# Altium schematic sheet PS1connections.schdoc
size 1181 x 848 mm
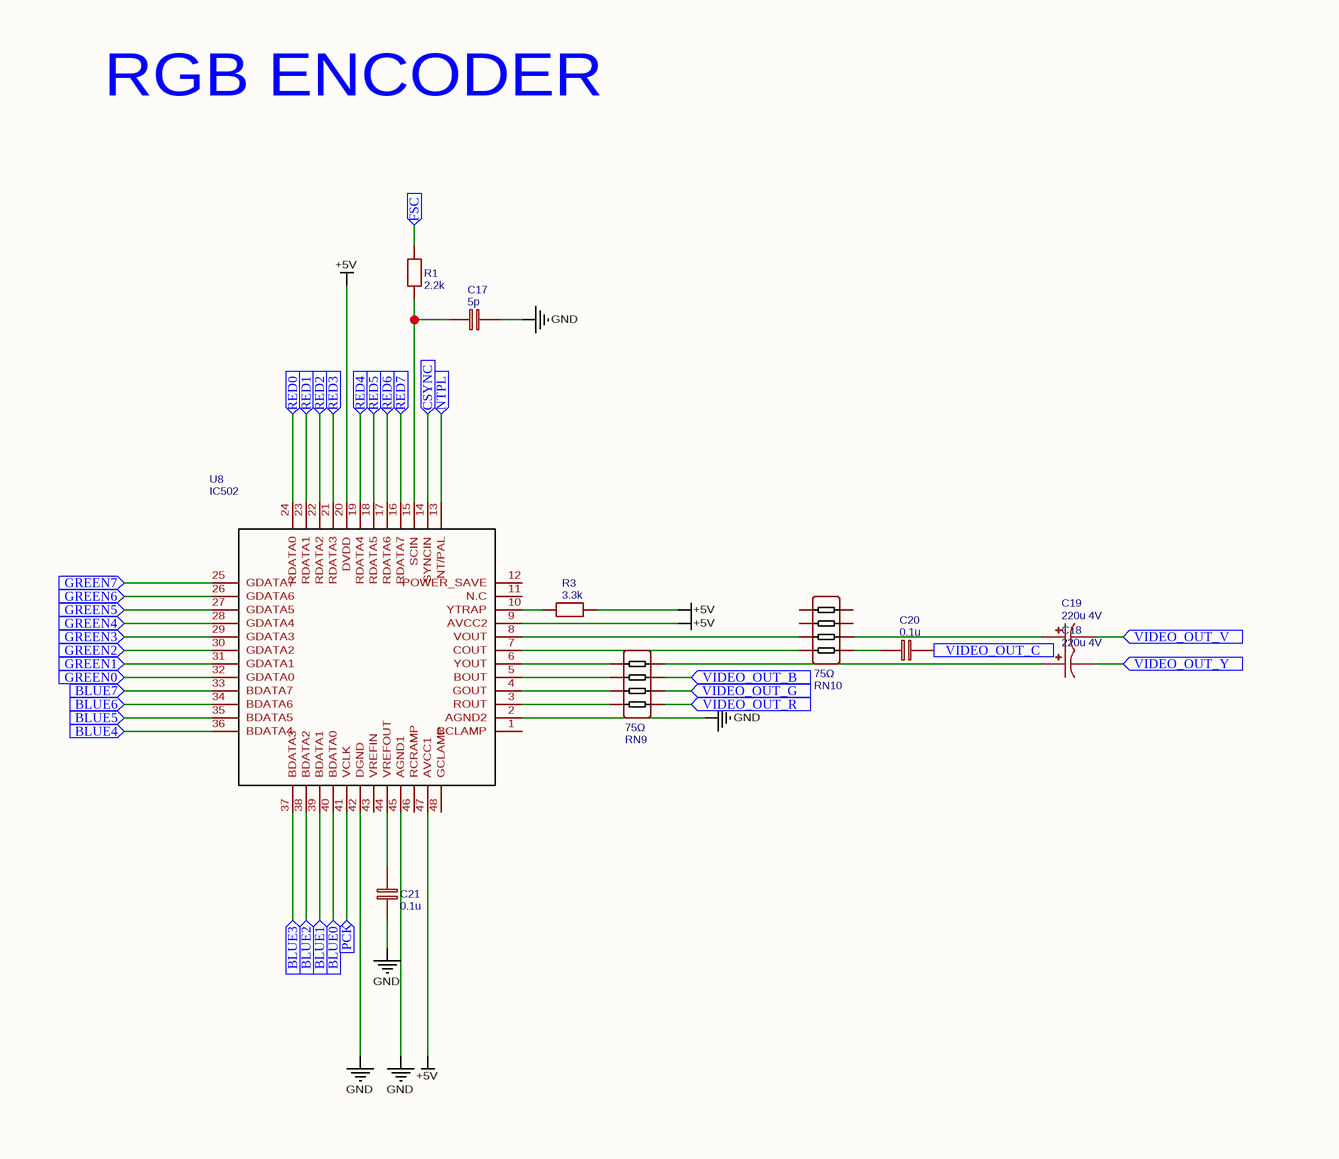
[diagram p0: PS1connections.schdoc, top column 1 of 4]
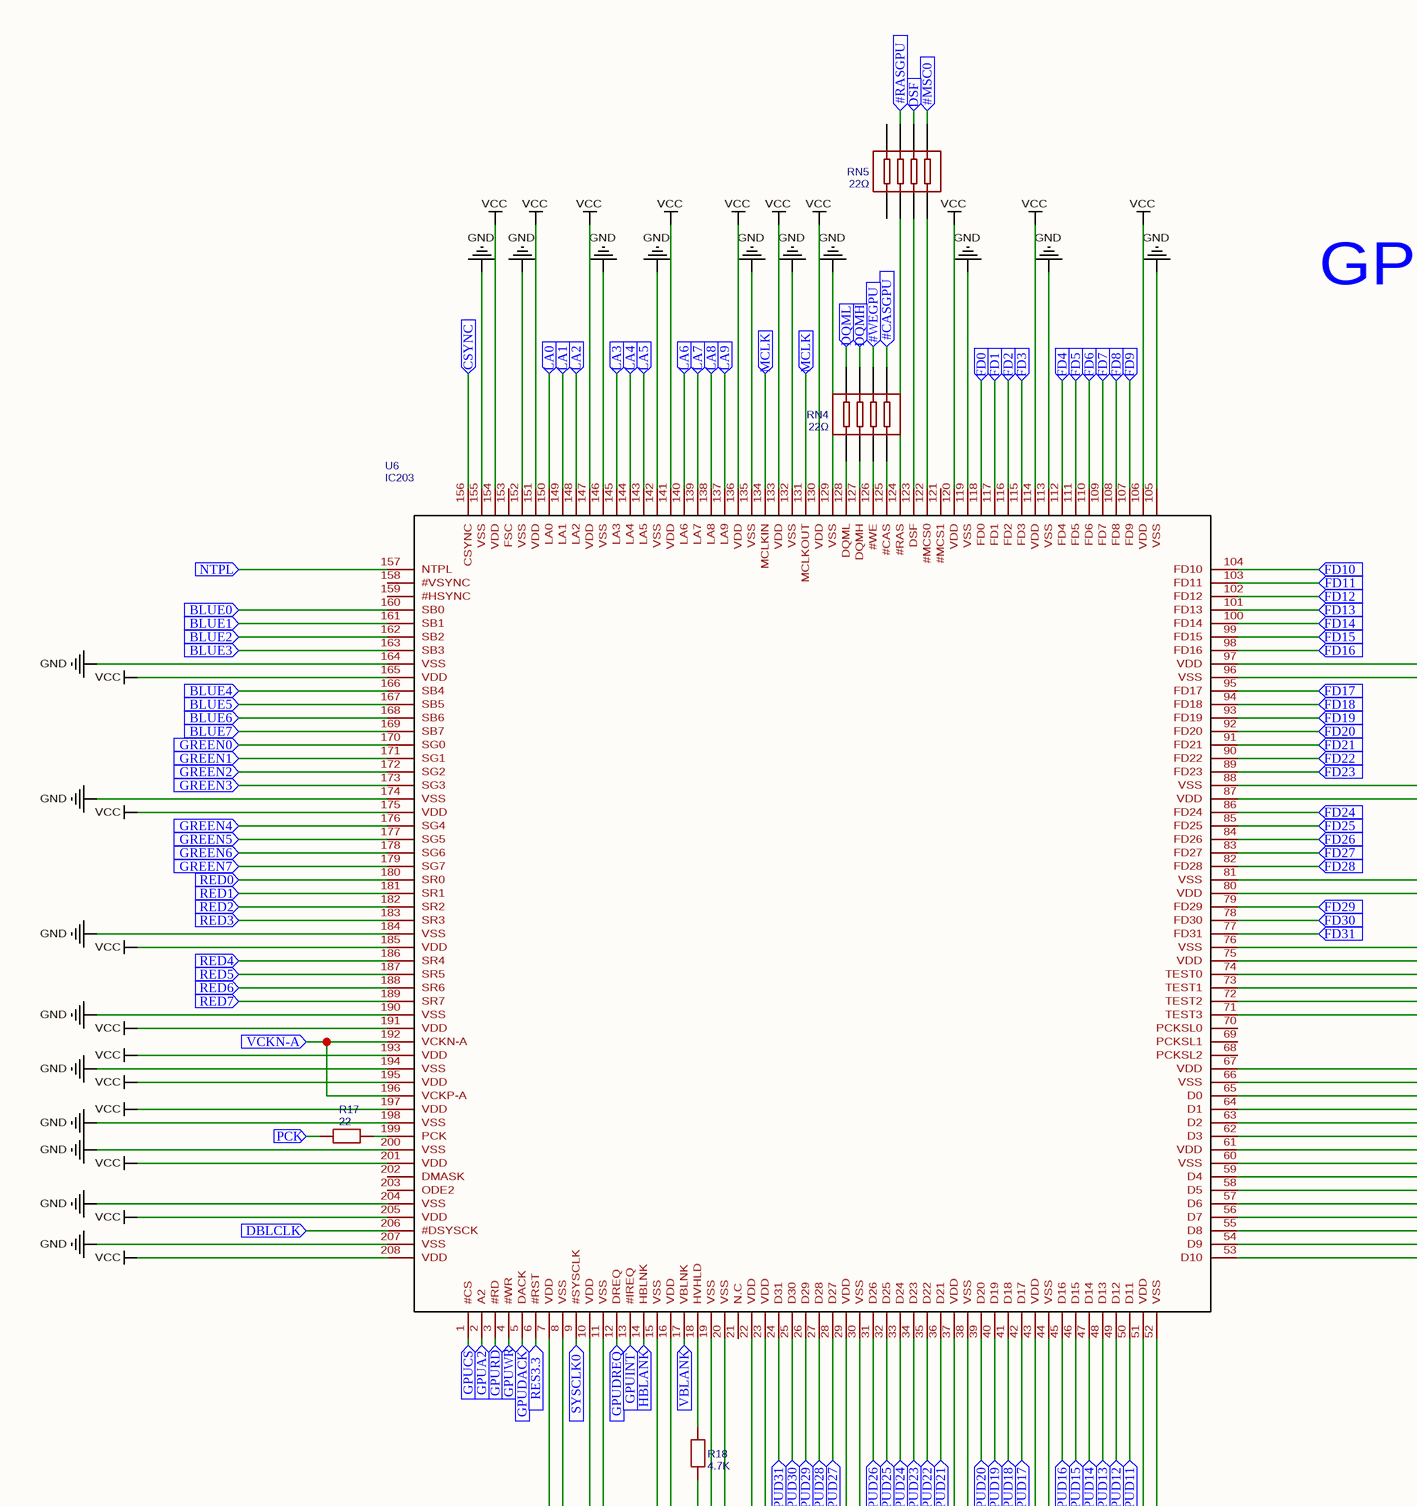
[diagram p1: PS1connections.schdoc, top column 2 of 4]
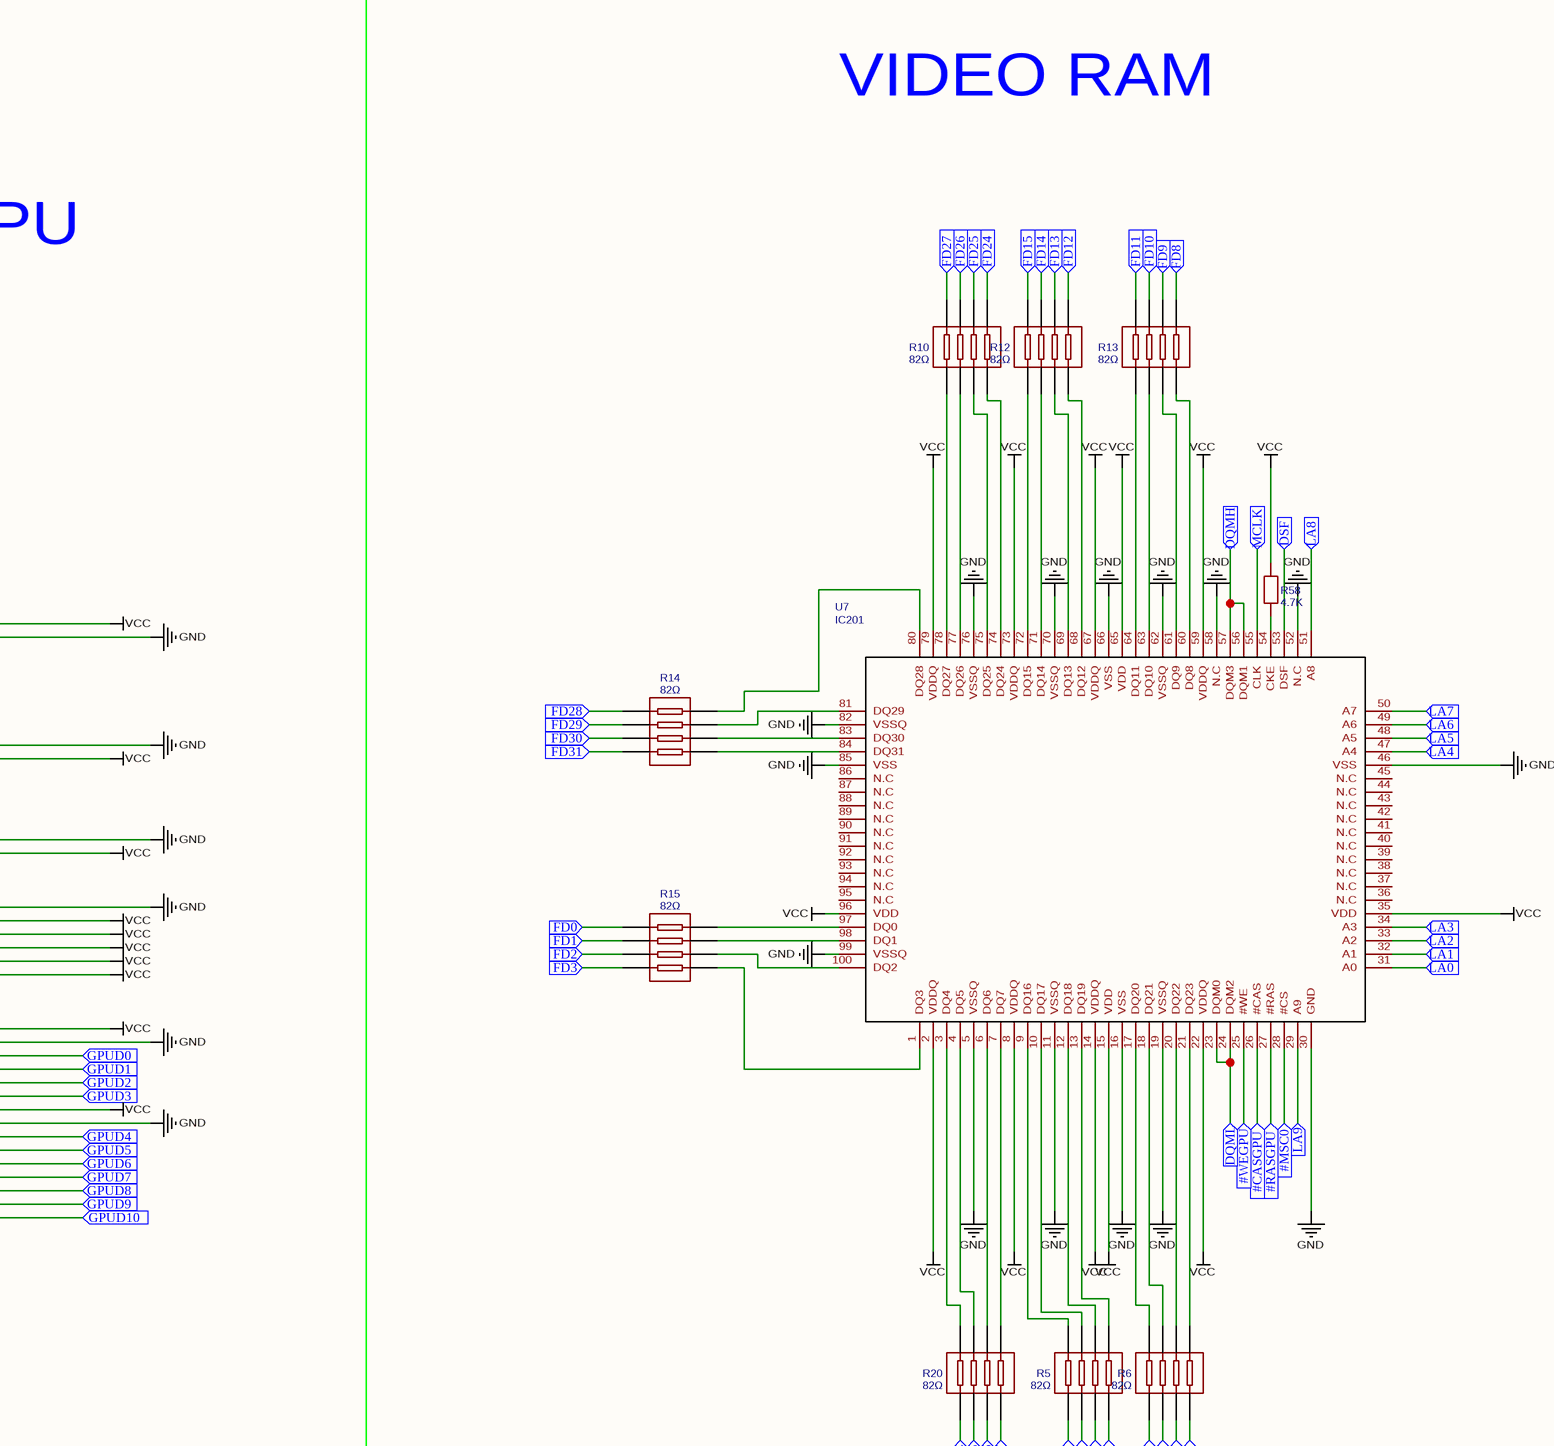
[diagram p2: PS1connections.schdoc, top column 3 of 4]
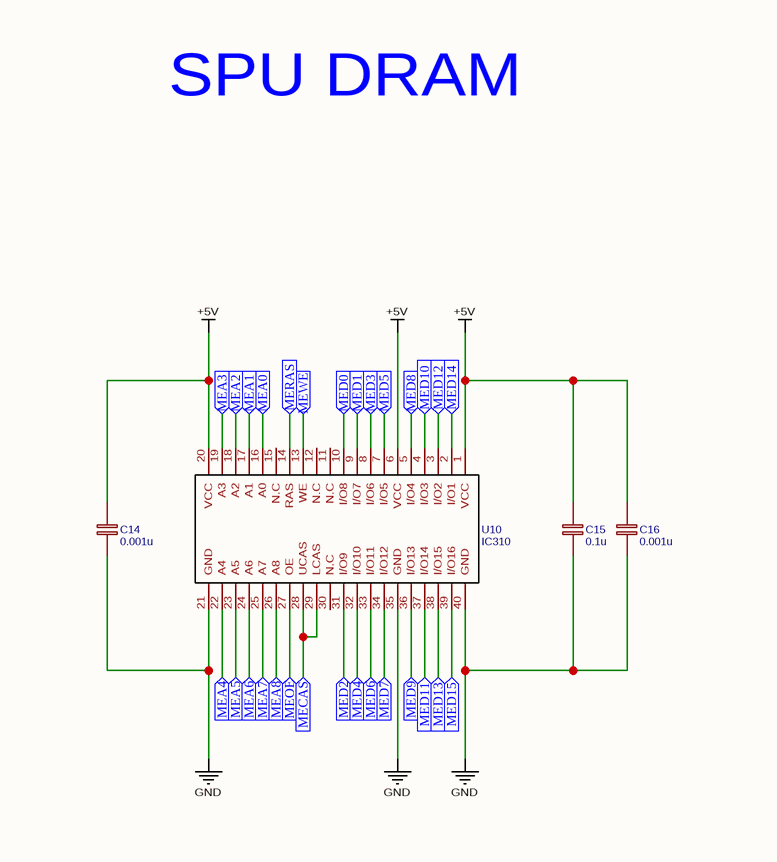
[diagram p3: PS1connections.schdoc, top column 4 of 4]
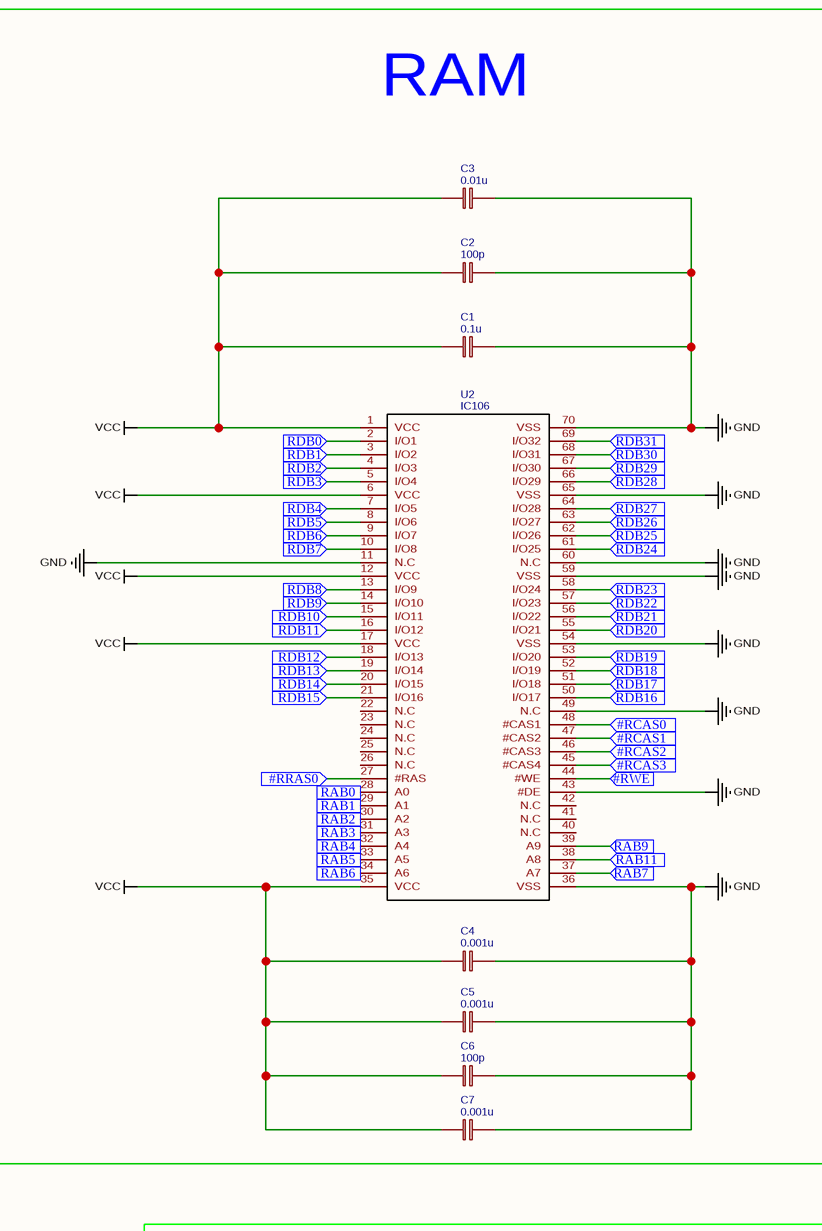
[diagram p4: PS1connections.schdoc, centre column 1 of 4]
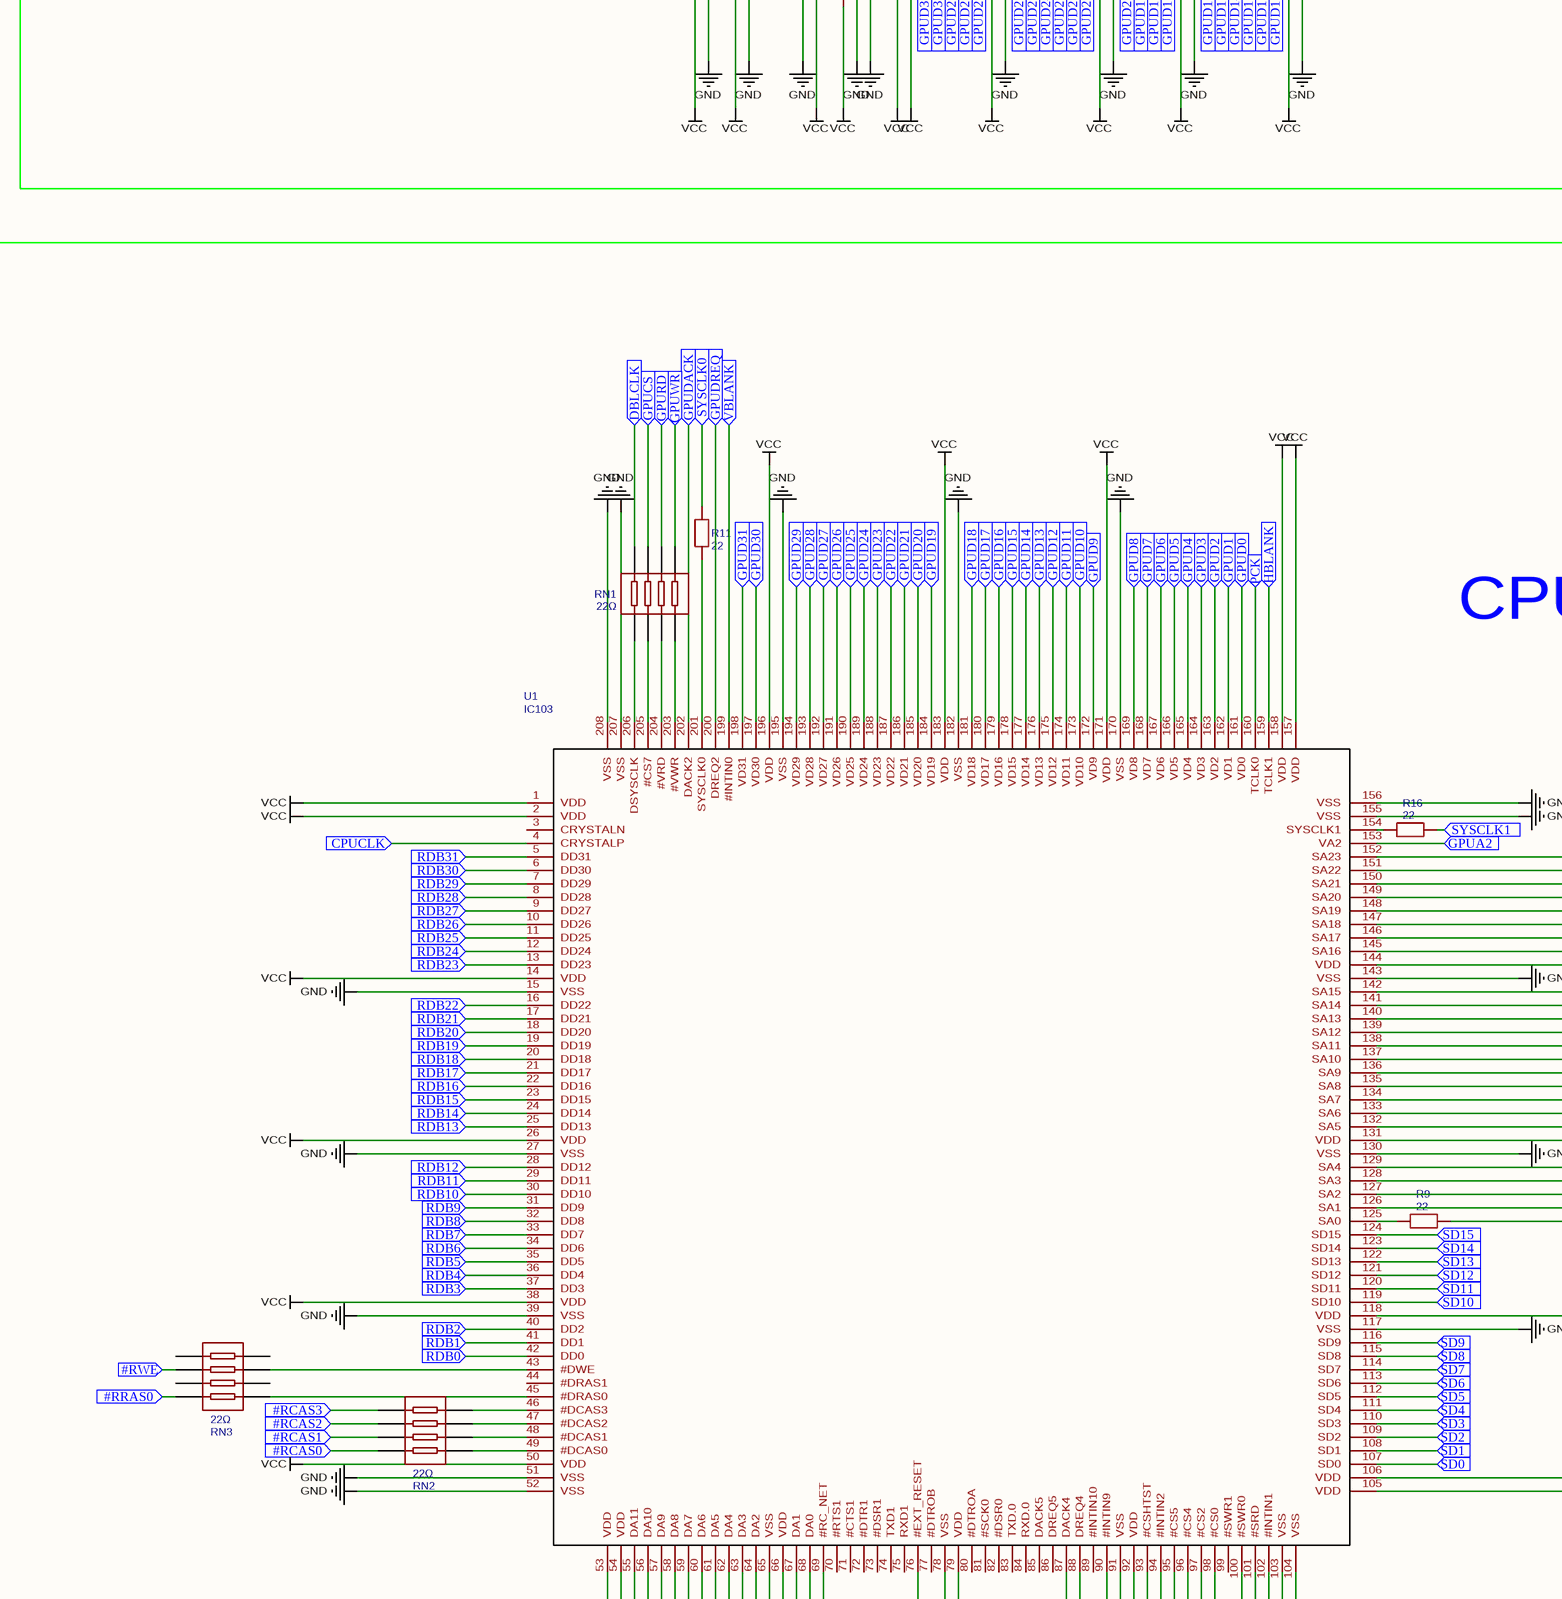
[diagram p5: PS1connections.schdoc, centre column 2 of 4]
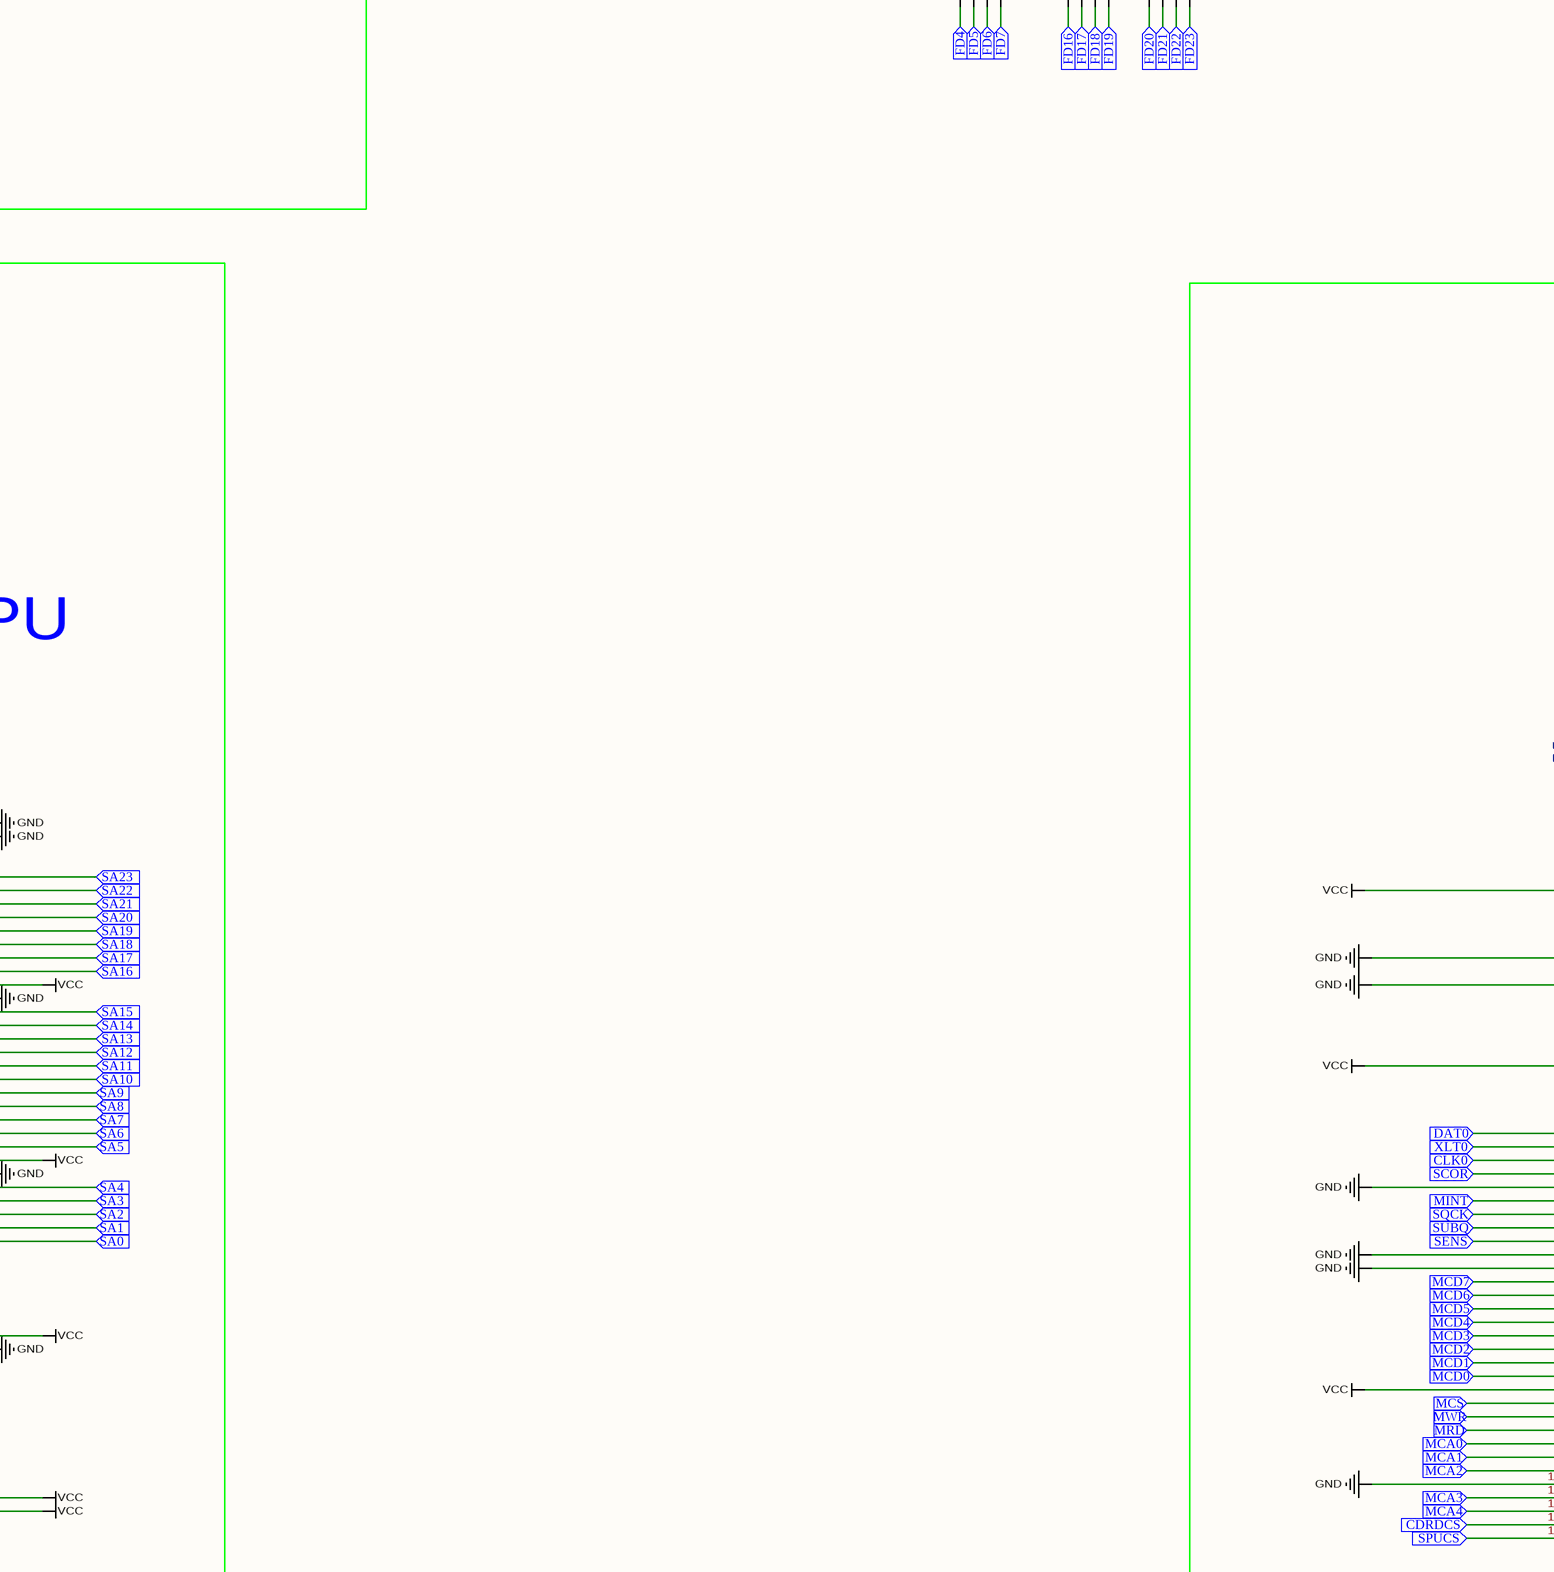
[diagram p6: PS1connections.schdoc, centre column 3 of 4]
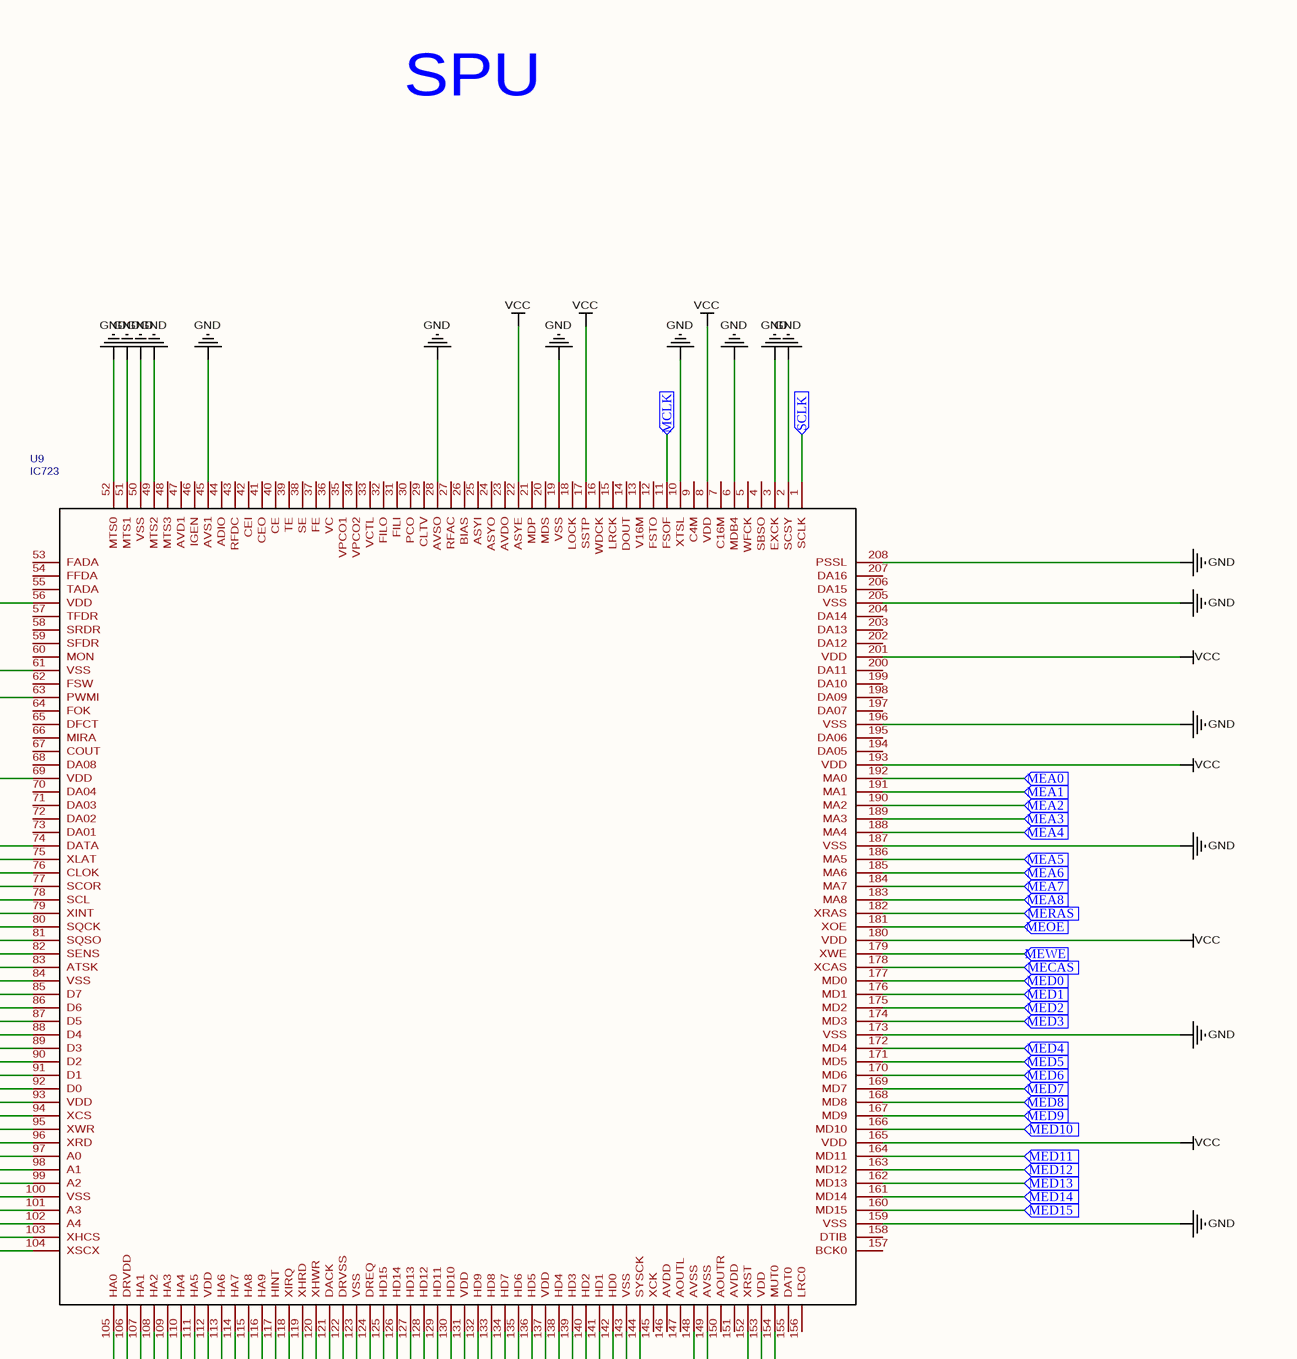
[diagram p7: PS1connections.schdoc, centre column 4 of 4]
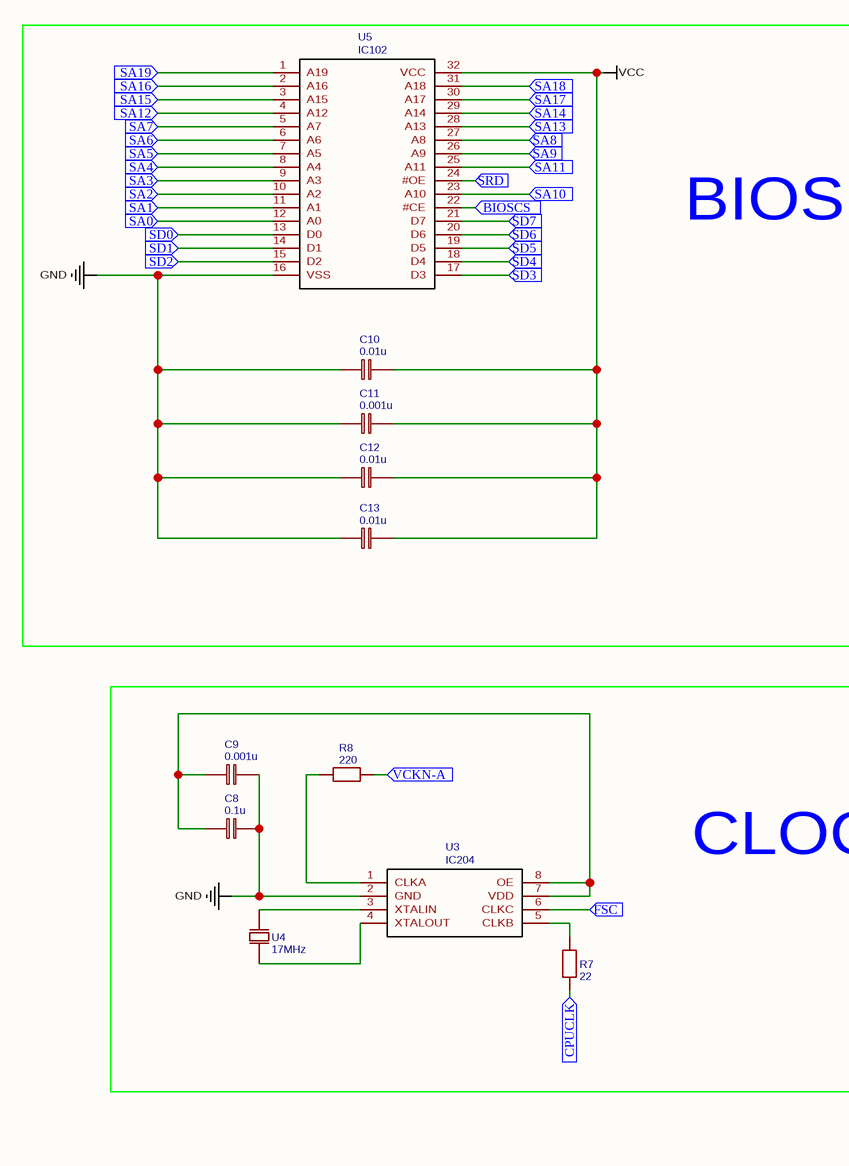
[diagram p8: PS1connections.schdoc, bottom column 1 of 4]
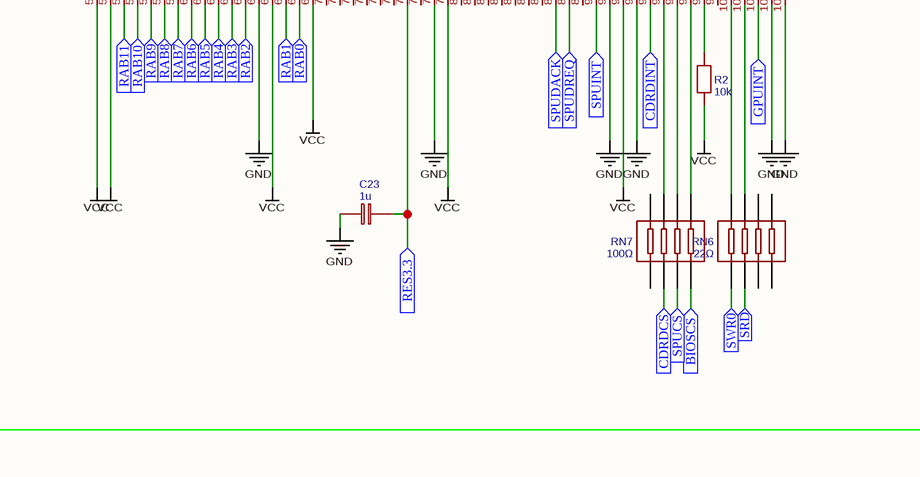
[diagram p9: PS1connections.schdoc, bottom column 2 of 4]
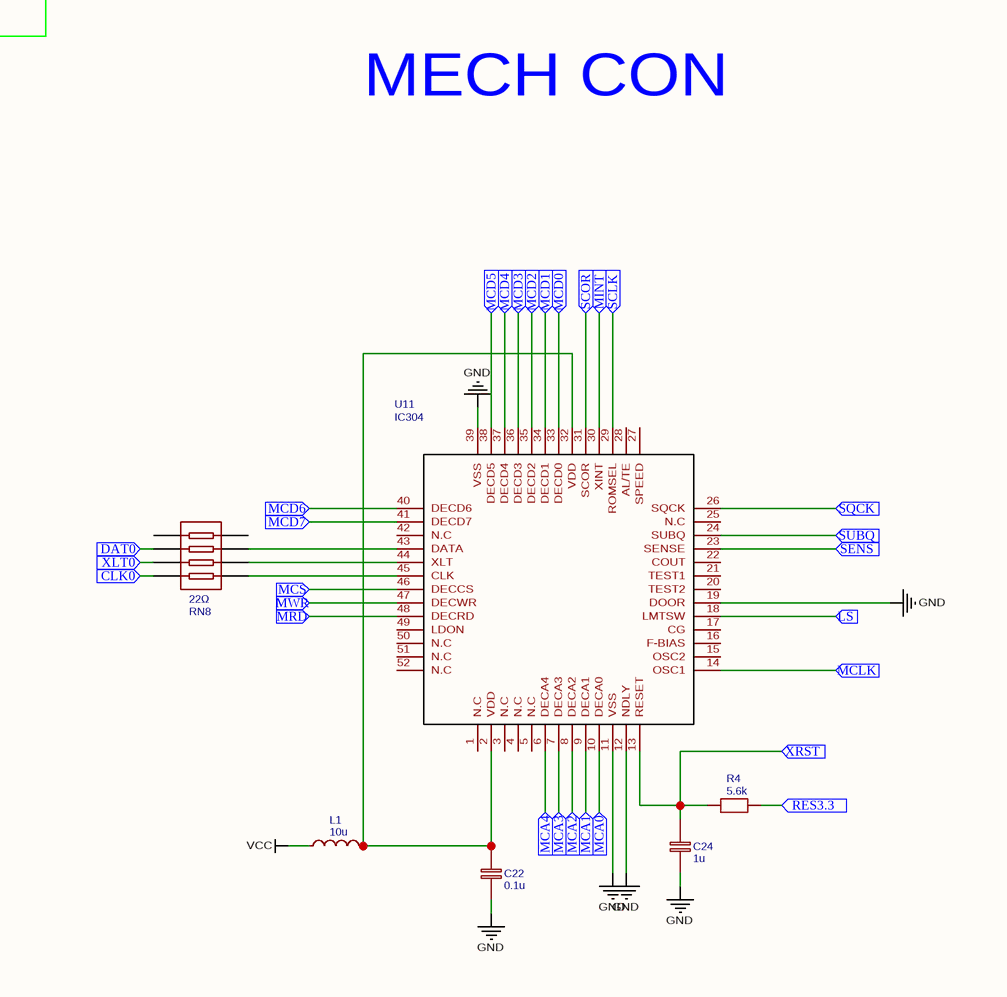
[diagram p10: PS1connections.schdoc, bottom column 3 of 4]
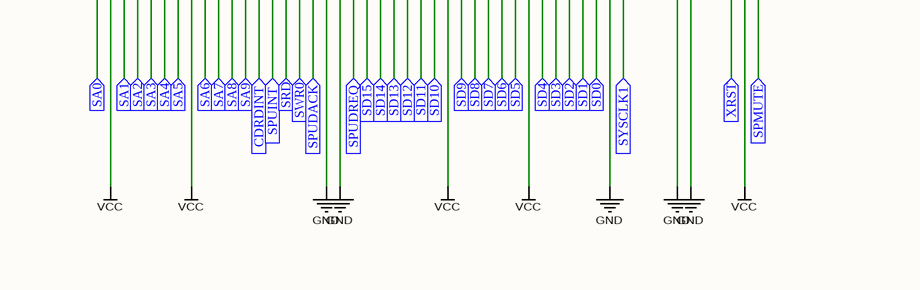
[diagram p11: PS1connections.schdoc, bottom column 4 of 4]

## Parts
C1  0.1u  [C0603]
C2  100p  [C0603]
C3  0.01u  [C0603]
C4  0.001u  [C0603]
C5  0.001u  [C0603]
C6  100p  [C0603]
C7  0.001u  [C0603]
C8  0.1u  [C0603]
C9  0.001u  [C0603]
C10  0.01u  [C0603]
C11  0.001u  [C0603]
C12  0.01u  [C0603]
C13  0.01u  [C0603]
C14  0.001u  [C0603]
C15  0.1u  [C0603]
C16  0.001u  [C0603]
C17  5p  [C0603]
C18  220u 4V  [CASE-A_3216]
C19  220u 4V  [CASE-A_3216]
C20  0.1u  [C0603]
C21  0.1u  [C0603]
C22  0.1u  [C0603]
C23  1u  [C0603]
C24  1u  [C0603]
L1  10u  [L0603]
R1  2.2k  [R0603]
R2  10k  [R0603]
R3  3.3k  [R0603]
R4  5.6k  [R0603]
R5  82Ω  [RES-ARRAY-SMD_8P-L2.0-W1.0-BL_CN24XXXX]
R6  82Ω  [RES-ARRAY-SMD_8P-L2.0-W1.0-BL_CN24XXXX]
R7  22  [R0603]
R8  220  [R0603]
R9  22  [R0603]
R10  82Ω  [RES-ARRAY-SMD_8P-L2.0-W1.0-BL_CN24XXXX]
R11  22  [R0603]
R12  82Ω  [RES-ARRAY-SMD_8P-L2.0-W1.0-BL_CN24XXXX]
R13  82Ω  [RES-ARRAY-SMD_8P-L2.0-W1.0-BL_CN24XXXX]
R14  82Ω  [RES-ARRAY-SMD_8P-L2.0-W1.0-BL_CN24XXXX]
R15  82Ω  [RES-ARRAY-SMD_8P-L2.0-W1.0-BL_CN24XXXX]
R16  22  [R0603]
R17  22  [R0603]
R18  4.7K  [R0603]
R20  82Ω  [RES-ARRAY-SMD_8P-L2.0-W1.0-BL_CN24XXXX]
R58  4.7K  [R0603]
RN1  22Ω  [RES-ARRAY-SMD_0402-8P-L2.0-W1.0-BL]
RN2  22Ω  [RES-ARRAY-SMD_0402-8P-L2.0-W1.0-BL]
RN3  22Ω  [RES-ARRAY-SMD_0402-8P-L2.0-W1.0-BL]
RN4  22Ω  [RES-ARRAY-SMD_0402-8P-L2.0-W1.0-BL]
RN5  22Ω  [RES-ARRAY-SMD_0402-8P-L2.0-W1.0-BL]
RN6  22Ω  [RES-ARRAY-SMD_0402-8P-L2.0-W1.0-BL]
RN7  100Ω  [RES-ARRAY-SMD_0402-8P-L2.0-W1.0-BL]
RN8  22Ω  [RES-ARRAY-SMD_0402-8P-L2.0-W1.0-BL]
RN9  75Ω  [RES-ARRAY-SMD_0402-8P-L2.0-W1.0-BL]
RN10  75Ω  [RES-ARRAY-SMD_0402-8P-L2.0-W1.0-BL]
U1  IC103  [LQFP-208_L28.0-W28.0-P0.50-LS30.0-BL]
U2  IC106  [SOJ-70_L27.0-W10.0-BL]
U3  IC204  [SOIC-8_L4.9-W3.9-P1.27-LS6.0-BL]
U4  17MHz  [CRYSTAL-SMD_L11.4-W3.8-LS13.4_HC-49S-SMD]
U5  IC102  [SOP-32_L20.9-W11.4-P1.27-LS14.12-BL]
U6  IC203  [LQFP-208_L28.0-W28.0-P0.50-LS30.0-BL]
U7  IC201  [LQFP-100_L20.0-W14.0-P0.65-LS16.0-BL-1]
U8  IC502  [QFP-48_L7.0-W7.0-P0.50-LS9.0-BL]
U9  IC723  [LQFP-208_L28.0-W28.0-P0.50-LS30.0-BL]
U10  IC310  [SOJ-40_L25.8-W10.2-P1.27-LS11.2-BL]
U11  IC304  [LQFP-52_L10.0-W10.0-P0.65-LS12.0-BL]

## Blocks framed on the sheet
GPU: R17 R18 RN4 RN5 U6
SPU DRAM: C14-C16 U10
RAM: C1-C7 U2
CPU: C23 R2 R9 R11 R16 RN1-RN3 RN6 RN7 U1
SPU: U9
BIOS ROM: C10-C13 U5
CLOCK GEN: C8 C9 R7 R8 U3 U4

## Ports
#CASGPU (in), #MSC0 (in), #RASGPU (in), #RCAS0 (in), #RCAS1 (in), #RCAS2 (in), #RCAS3 (in), #RRAS0 (in), #RWE (in), #WEGPU (in), BIOSCS (in), BLUE0 (in), BLUE1 (in), BLUE2 (in), BLUE3 (in), BLUE4 (in), BLUE5 (in), BLUE6 (in), BLUE7 (in), CDRDCS (in), CDRDINT (in), CLK0 (in), CPUCLK (in), CSYNC (in), DAT0 (in), DBLCLK (in), DQMH (in), DQML (in), DSF (in), FD0 (in), FD1 (in), FD2 (in), FD3 (in), FD4 (in), FD5 (in), FD6 (in), FD7 (in), FD8 (in), FD9 (in), FD10 (in), FD11 (in), FD12 (in), FD13 (in), FD14 (in), FD15 (in), FD16 (in), FD17 (in), FD18 (in), FD19 (in), FD20 (in), FD21 (in), FD22 (in), FD23 (in), FD24 (in), FD25 (in), FD26 (in), FD27 (in), FD28 (in), FD29 (in), FD30 (in), FD31 (in), FSC (in), GPUA2 (in), GPUCS (in), GPUD0 (in), GPUD1 (in), GPUD2 (in), GPUD3 (in), GPUD4 (in), GPUD5 (in), GPUD6 (in), GPUD7 (in), GPUD8 (in), GPUD9 (in), GPUD10 (in), GPUD11 (in), GPUD12 (in), GPUD13 (in), GPUD14 (in), GPUD15 (in), GPUD16 (in), GPUD17 (in), GPUD18 (in), GPUD19 (in), GPUD20 (in), GPUD21 (in), GPUD22 (in), GPUD23 (in), GPUD24 (in), GPUD25 (in), GPUD26 (in), GPUD27 (in), GPUD28 (in), GPUD29 (in), GPUD30 (in), GPUD31 (in), GPUDACK (in), GPUDREQ (in), GPUINT (in), GPURD (in), GPUWR (in), GREEN0 (in), GREEN1 (in), GREEN2 (in), GREEN3 (in), GREEN4 (in), GREEN5 (in), GREEN6 (in), GREEN7 (in), HBLANK (in), LA0 (in), LA1 (in), LA2 (in), LA3 (in), LA4 (in), LA5 (in), LA6 (in), LA7 (in), LA8 (in), LA9 (in), LS (in), MCA0 (in), MCA1 (in), MCA2 (in), MCA3 (in), MCA4 (in), MCD0 (in), MCD1 (in), MCD2 (in), MCD3 (in), MCD4 (in), MCD5 (in), MCD6 (in), MCD7 (in), MCLK (in), MCS (in), MEA0 (in), MEA1 (in), MEA2 (in), MEA3 (in), MEA4 (in), MEA5 (in), MEA6 (in), MEA7 (in), MEA8 (in), MECAS (in), MED0 (in), MED1 (in), MED2 (in), MED3 (in), MED4 (in), MED5 (in), MED6 (in), MED7 (in), MED8 (in), MED9 (in), MED10 (in), MED11 (in), MED12 (in), MED13 (in), MED14 (in), MED15 (in), MEOE (in), MERAS (in), MEWE (in), MINT (in), MRD (in), MWR (in), NTPL (in), PCK (in), RAB0 (in), RAB1 (in), RAB2 (in), RAB3 (in), RAB4 (in), RAB5 (in), RAB6 (in), RAB7 (in), RAB8 (in), RAB9 (in), RAB10 (in), RAB11 (in), RDB0 (in), RDB1 (in), RDB2 (in), RDB3 (in), RDB4 (in), RDB5 (in), RDB6 (in), RDB7 (in), RDB8 (in), RDB9 (in), RDB10 (in), RDB11 (in), RDB12 (in), RDB13 (in), RDB14 (in), RDB15 (in), RDB16 (in), RDB17 (in), RDB18 (in), RDB19 (in), RDB20 (in), RDB21 (in), RDB22 (in), RDB23 (in), RDB24 (in), RDB25 (in), RDB26 (in), RDB27 (in), RDB28 (in), RDB29 (in), RDB30 (in), RDB31 (in), RED0 (in), RED1 (in), RED2 (in), RED3 (in), RED4 (in), RED5 (in), RED6 (in), RED7 (in), RES3.3 (in), SA0 (in), SA1 (in), SA2 (in), SA3 (in), SA4 (in), SA5 (in), SA6 (in), SA7 (in), SA8 (in), SA9 (in), SA10 (in), SA11 (in), SA12 (in), SA13 (in), SA14 (in), SA15 (in), SA16 (in), SA17 (in), SA18 (in), SA19 (in), SA20 (in), SA21 (in), SA22 (in), SA23 (in), SCLK (in), SCOR (in), SD0 (in), SD1 (in), SD2 (in), SD3 (in), SD4 (in), SD5 (in), SD6 (in), SD7 (in), SD8 (in), SD9 (in), SD10 (in), SD11 (in), SD12 (in), SD13 (in), SD14 (in), SD15 (in), SENS (in), SPMUTE (in), SPUCS (in), SPUDACK (in), SPUDREQ (in), SPUINT (in), SQCK (in), SRD (in), SUBQ (in), SWR0 (in), SYSCLK0 (in), SYSCLK1 (in), VBLANK (in), VCKN-A (in), VIDEO_OUT_B (in), VIDEO_OUT_C (in), VIDEO_OUT_G (in), VIDEO_OUT_R (in), VIDEO_OUT_V (in), VIDEO_OUT_Y (in), XLT0 (in), XRST (in)

## Nets
+5V: C14.2 C15.2 C16.2 R3.2 U8.9(AVCC2) U8.20(DVDD) U8.47(AVCC1) U10.1(VCC) U10.6(VCC) U10.20(VCC)
GND: C1.2 C2.2 C3.2 C4.2 C5.2 C6.2 C7.2 C8.2 C9.2 C10.1 C11.1 C12.1 C13.1 C14.1 C15.1 C16.1 C17.2 C21.1 C22.1 C23.1 C24.1 U1.15(VSS) U1.27(VSS) U1.39(VSS) U1.51(VSS) U1.52(VSS) U1.65(VSS) U1.78(VSS) U1.91(VSS) U1.93(#CSHTST) U1.103(VSS) U1.104(VSS) U1.117(VSS) U1.130(VSS) U1.143(VSS) U1.155(VSS) U1.156(VSS) U1.170(VSS) U1.182(VSS) U1.195(VSS) U1.207(VSS) U1.208(VSS) U2.11(N.C) U2.36(VSS) U2.43(#DE) U2.49(N.C) U2.54(VSS) U2.59(VSS) U2.60(N.C) U2.65(VSS) U2.70(VSS) U3.2(GND) U5.16(VSS) U6.8(VSS) U6.11(VSS) U6.15(VSS) U6.19(VSS) U6.20(VSS) U6.30(VSS) U6.38(VSS) U6.44(VSS) U6.52(VSS) U6.60(VSS) U6.66(VSS) U6.76(VSS) U6.81(VSS) U6.88(VSS) U6.96(VSS) U6.105(VSS) U6.113(VSS) U6.119(VSS) U6.129(VSS) U6.132(VSS) U6.135(VSS) U6.142(VSS) U6.146(VSS) U6.152(VSS) U6.155(VSS) U6.164(VSS) U6.174(VSS) U6.184(VSS) U6.190(VSS) U6.194(VSS) U6.198(VSS) U6.200(VSS) U6.204(VSS) U6.207(VSS) U7.5(VSSQ) U7.11(VSSQ) U7.16(VSS) U7.19(VSSQ) U7.30(GND) U7.46(VSS) U7.52(N.C) U7.58(N.C) U7.62(VSSQ) U7.66(VSS) U7.70(VSSQ) U7.76(VSSQ) U7.82(VSSQ) U7.85(VSS) U7.99(VSSQ) U8.2(AGND2) U8.42(DGND) U8.45(AGND1) U9.2(SCSY) U9.3(EXCK) U9.6(MDB4) U9.10(XTSL) U9.19(VSS) U9.28(AVSO) U9.45(AVS1) U9.49(MTS2) U9.50(VSS) U9.51(MTS1) U9.52(MTS0) U9.61(VSS) U9.63(PWMI) U9.78(SCL) U9.83(ATSK) U9.84(VSS) U9.100(VSS) U9.122(DRVSS) U9.123(VSS) U9.143(VSS) U9.148(AVSS) U9.149(AVSS) U9.159(VSS) U9.173(VSS) U9.187(VSS) U9.196(VSS) U9.205(VSS) U9.208(PSSL) U10.21(GND) U10.35(GND) U10.40(GND) U11.11(VSS) U11.12(NDLY) U11.19(DOOR) U11.39(VSS)
VCC: C1.1 C2.1 C3.1 C4.1 C5.1 C6.1 C7.1 C10.2 C11.2 C12.2 C13.2 L1.1 R2.1 R18.2 R58.2 U1.1(VDD) U1.2(VDD) U1.14(VDD) U1.26(VDD) U1.38(VDD) U1.50(VDD) U1.53(VDD) U1.54(VDD) U1.66(VDD) U1.69(#RC_NET) U1.79(VDD) U1.92(VDD) U1.105(VDD) U1.106(VDD) U1.118(VDD) U1.131(VDD) U1.144(VDD) U1.157(VDD) U1.158(VDD) U1.171(VDD) U1.183(VDD) U1.196(VDD) U2.1(VCC) U2.6(VCC) U2.12(VCC) U2.17(VCC) U2.35(VCC) U5.32(VCC) U6.7(VDD) U6.10(VDD) U6.16(VDD) U6.22(VDD) U6.23(VDD) U6.29(VDD) U6.37(VDD) U6.43(VDD) U6.51(VDD) U6.61(VDD) U6.67(VDD) U6.71(TEST3) U6.72(TEST2) U6.73(TEST1) U6.74(TEST0) U6.75(VDD) U6.80(VDD) U6.87(VDD) U6.97(VDD) U6.106(VDD) U6.114(VDD) U6.120(VDD) U6.130(VDD) U6.133(VDD) U6.136(VDD) U6.141(VDD) U6.147(VDD) U6.151(VDD) U6.154(VDD) U6.165(VDD) U6.175(VDD) U6.185(VDD) U6.191(VDD) U6.193(VDD) U6.195(VDD) U6.197(VDD) U6.201(VDD) U6.205(VDD) U6.208(VDD) U7.2(VDDQ) U7.8(VDDQ) U7.14(VDDQ) U7.15(VDD) U7.22(VDDQ) U7.35(VDD) U7.59(VDDQ) U7.65(VDD) U7.67(VDDQ) U7.73(VDDQ) U7.79(VDDQ) U7.96(VDD) U9.8(VDD) U9.17(SSTP) U9.22(ASYE) U9.56(VDD) U9.69(VDD) U9.93(VDD) U9.106(DRVDD) U9.112(VDD) U9.131(VDD) U9.137(VDD) U9.153(VDD) U9.165(VDD) U9.180(VDD) U9.193(VDD) U9.201(VDD)
#CASGPU: RN4.8 U7.26(#CAS) ; port #CASGPU
#MSC0: RN5.8 U7.28(#CS) ; port #MSC0
#RASGPU: RN5.6 U7.27(#RAS) ; port #RASGPU
#RCAS0: RN2.5 U2.48(#CAS1) ; port #RCAS0
#RCAS1: RN2.6 U2.47(#CAS2) ; port #RCAS1
#RCAS2: RN2.7 U2.46(#CAS3) ; port #RCAS2
#RCAS3: RN2.8 U2.45(#CAS4) ; port #RCAS3
#RRAS0: RN3.5 U2.27(#RAS) ; port #RRAS0
#RWE: RN3.7 U2.44(#WE) ; port #RWE
#WEGPU: RN4.7 U7.25(#WE) ; port #WEGPU
BIOSCS: RN7.1 U5.22(#CE) ; port BIOSCS
BLUE0: U6.160(SB0) U8.40(BDATA0) ; port BLUE0
BLUE1: U6.161(SB1) U8.39(BDATA1) ; port BLUE1
BLUE2: U6.162(SB2) U8.38(BDATA2) ; port BLUE2
BLUE3: U6.163(SB3) U8.37(BDATA3) ; port BLUE3
BLUE4: U6.166(SB4) U8.36(BDATA4) ; port BLUE4
BLUE5: U6.167(SB5) U8.35(BDATA5) ; port BLUE5
BLUE6: U6.168(SB6) U8.34(BDATA6) ; port BLUE6
BLUE7: U6.169(SB7) U8.33(BDATA7) ; port BLUE7
CDRDCS: RN7.3 U9.103(XHCS) ; port CDRDCS
CDRDINT: U1.94(#INTIN2) U9.117(HINT) ; port CDRDINT
CLK0: RN8.1 U9.76(CLOK) ; port CLK0
CPUCLK: R7.1 U1.4(CRYSTALP) ; port CPUCLK
CSYNC: U6.156(CSYNC) U8.14(SYNCIN) ; port CSYNC
DAT0: RN8.3 U9.74(DATA) ; port DAT0
DBLCLK: RN1.5 U6.206(#DSYSCK) ; port DBLCLK
DQMH: RN4.6 U7.56(DQM1) U7.57(DQM3) ; port DQMH
DQML: RN4.5 U7.23(DQM0) U7.24(DQM2) ; port DQML
DSF: RN5.7 U7.53(DSF) ; port DSF
FD0: R15.8 U6.118(FD0) ; port FD0
FD1: R15.7 U6.117(FD1) ; port FD1
FD2: R15.6 U6.116(FD2) ; port FD2
FD3: R15.5 U6.115(FD3) ; port FD3
FD4: R20.4 U6.112(FD4) ; port FD4
FD5: R20.3 U6.111(FD5) ; port FD5
FD6: R20.2 U6.110(FD6) ; port FD6
FD7: R20.1 U6.109(FD7) ; port FD7
FD8: R13.8 U6.108(FD8) ; port FD8
FD9: R13.7 U6.107(FD9) ; port FD9
FD10: R13.6 U6.104(FD10) ; port FD10
FD11: R13.5 U6.103(FD11) ; port FD11
FD12: R12.8 U6.102(FD12) ; port FD12
FD13: R12.7 U6.101(FD13) ; port FD13
FD14: R12.6 U6.100(FD14) ; port FD14
FD15: R12.5 U6.99(FD15) ; port FD15
FD16: R5.4 U6.98(FD16) ; port FD16
FD17: R5.3 U6.95(FD17) ; port FD17
FD18: R5.2 U6.94(FD18) ; port FD18
FD19: R5.1 U6.93(FD19) ; port FD19
FD20: R6.4 U6.92(FD20) ; port FD20
FD21: R6.3 U6.91(FD21) ; port FD21
FD22: R6.2 U6.90(FD22) ; port FD22
FD23: R6.1 U6.89(FD23) ; port FD23
FD24: R10.8 U6.86(FD24) ; port FD24
FD25: R10.7 U6.85(FD25) ; port FD25
FD26: R10.6 U6.84(FD26) ; port FD26
FD27: R10.5 U6.83(FD27) ; port FD27
FD28: R14.8 U6.82(FD28) ; port FD28
FD29: R14.7 U6.79(FD29) ; port FD29
FD30: R14.6 U6.78(FD30) ; port FD30
FD31: R14.5 U6.77(FD31) ; port FD31
FSC: R1.2 U3.6(CLKC) ; port FSC
GPUA2: U1.153(VA2) U6.2(A2) ; port GPUA2
GPUCS: RN1.6 U6.1(#CS) ; port GPUCS
GPUD0: U1.161(VD0) U6.65(D0) ; port GPUD0
GPUD1: U1.162(VD1) U6.64(D1) ; port GPUD1
GPUD2: U1.163(VD2) U6.63(D2) ; port GPUD2
GPUD3: U1.164(VD3) U6.62(D3) ; port GPUD3
GPUD4: U1.165(VD4) U6.59(D4) ; port GPUD4
GPUD5: U1.166(VD5) U6.58(D5) ; port GPUD5
GPUD6: U1.167(VD6) U6.57(D6) ; port GPUD6
GPUD7: U1.168(VD7) U6.56(D7) ; port GPUD7
GPUD8: U1.169(VD8) U6.55(D8) ; port GPUD8
GPUD9: U1.172(VD9) U6.54(D9) ; port GPUD9
GPUD10: U1.173(VD10) U6.53(D10) ; port GPUD10
GPUD11: U1.174(VD11) U6.50(D11) ; port GPUD11
GPUD12: U1.175(VD12) U6.49(D12) ; port GPUD12
GPUD13: U1.176(VD13) U6.48(D13) ; port GPUD13
GPUD14: U1.177(VD14) U6.47(D14) ; port GPUD14
GPUD15: U1.178(VD15) U6.46(D15) ; port GPUD15
GPUD16: U1.179(VD16) U6.45(D16) ; port GPUD16
GPUD17: U1.180(VD17) U6.42(D17) ; port GPUD17
GPUD18: U1.181(VD18) U6.41(D18) ; port GPUD18
GPUD19: U1.184(VD19) U6.40(D19) ; port GPUD19
GPUD20: U1.185(VD20) U6.39(D20) ; port GPUD20
GPUD21: U1.186(VD21) U6.36(D21) ; port GPUD21
GPUD22: U1.187(VD22) U6.35(D22) ; port GPUD22
GPUD23: U1.188(VD23) U6.34(D23) ; port GPUD23
GPUD24: U1.189(VD24) U6.33(D24) ; port GPUD24
GPUD25: U1.190(VD25) U6.32(D25) ; port GPUD25
GPUD26: U1.191(VD26) U6.31(D26) ; port GPUD26
GPUD27: U1.192(VD27) U6.28(D27) ; port GPUD27
GPUD28: U1.193(VD28) U6.27(D28) ; port GPUD28
GPUD29: U1.194(VD29) U6.26(D29) ; port GPUD29
GPUD30: U1.197(VD30) U6.25(D30) ; port GPUD30
GPUD31: U1.198(VD31) U6.24(D31) ; port GPUD31
GPUDACK: U1.202(DACK2) U6.5(DACK) ; port GPUDACK
GPUDREQ: U1.200(DREQ2) U6.12(DREQ) ; port GPUDREQ
GPUINT: U1.102(#INTIN1) U6.13(#IREQ) ; port GPUINT
GPURD: RN1.7 U6.3(#RD) ; port GPURD
GPUWR: RN1.8 U6.4(#WR) ; port GPUWR
GREEN0: U6.170(SG0) U8.32(GDATA0) ; port GREEN0
GREEN1: U6.171(SG1) U8.31(GDATA1) ; port GREEN1
GREEN2: U6.172(SG2) U8.30(GDATA2) ; port GREEN2
GREEN3: U6.173(SG3) U8.29(GDATA3) ; port GREEN3
GREEN4: U6.176(SG4) U8.28(GDATA4) ; port GREEN4
GREEN5: U6.177(SG5) U8.27(GDATA5) ; port GREEN5
GREEN6: U6.178(SG6) U8.26(GDATA6) ; port GREEN6
GREEN7: U6.179(SG7) U8.25(GDATA7) ; port GREEN7
HBLANK: U1.159(TCLK1) U6.14(HBLNK) ; port HBLANK
LA0: U6.150(LA0) U7.31(A0) ; port LA0
LA1: U6.149(LA1) U7.32(A1) ; port LA1
LA2: U6.148(LA2) U7.33(A2) ; port LA2
LA3: U6.145(LA3) U7.34(A3) ; port LA3
LA4: U6.144(LA4) U7.47(A4) ; port LA4
LA5: U6.143(LA5) U7.48(A5) ; port LA5
LA6: U6.140(LA6) U7.49(A6) ; port LA6
LA7: U6.139(LA7) U7.50(A7) ; port LA7
LA8: U6.138(LA8) U7.51(A8) ; port LA8
LA9: U6.137(LA9) U7.29(A9) ; port LA9
LS: U11.18(LMTSW) ; port LS
MCA0: U9.97(A0) U11.10(DECA0) ; port MCA0
MCA1: U9.98(A1) U11.9(DECA1) ; port MCA1
MCA2: U9.99(A2) U11.8(DECA2) ; port MCA2
MCA3: U9.101(A3) U11.7(DECA3) ; port MCA3
MCA4: U9.102(A4) U11.6(DECA4) ; port MCA4
MCD0: U9.92(D0) U11.33(DECD0) ; port MCD0
MCD1: U9.91(D1) U11.34(DECD1) ; port MCD1
MCD2: U9.90(D2) U11.35(DECD2) ; port MCD2
MCD3: U9.89(D3) U11.36(DECD3) ; port MCD3
MCD4: U9.88(D4) U11.37(DECD4) ; port MCD4
MCD5: U9.87(D5) U11.38(DECD5) ; port MCD5
MCD6: U9.86(D6) U11.40(DECD6) ; port MCD6
MCD7: U9.85(D7) U11.41(DECD7) ; port MCD7
MCLK: U6.131(MCLKOUT) U6.134(MCLKIN) U7.55(CLK) U9.11(FSOF) U11.14(OSC1) ; port MCLK
MCS: U9.94(XCS) U11.46(DECCS) ; port MCS
MEA0: U9.192(MA0) U10.16(A0) ; port MEA0
MEA1: U9.191(MA1) U10.17(A1) ; port MEA1
MEA2: U9.190(MA2) U10.18(A2) ; port MEA2
MEA3: U9.189(MA3) U10.19(A3) ; port MEA3
MEA4: U9.188(MA4) U10.22(A4) ; port MEA4
MEA5: U9.186(MA5) U10.23(A5) ; port MEA5
MEA6: U9.185(MA6) U10.24(A6) ; port MEA6
MEA7: U9.184(MA7) U10.25(A7) ; port MEA7
MEA8: U9.183(MA8) U10.26(A8) ; port MEA8
MECAS: U9.178(XCAS) U10.28(UCAS) U10.29(LCAS) ; port MECAS
MED0: U9.177(MD0) U10.10(I/O8) ; port MED0
MED1: U9.176(MD1) U10.9(I/O7) ; port MED1
MED2: U9.175(MD2) U10.31(I/O9) ; port MED2
MED3: U9.174(MD3) U10.8(I/O6) ; port MED3
MED4: U9.172(MD4) U10.32(I/O10) ; port MED4
MED5: U9.171(MD5) U10.7(I/O5) ; port MED5
MED6: U9.170(MD6) U10.33(I/O11) ; port MED6
MED7: U9.169(MD7) U10.34(I/O12) ; port MED7
MED8: U9.168(MD8) U10.5(I/O4) ; port MED8
MED9: U9.167(MD9) U10.36(I/O13) ; port MED9
MED10: U9.166(MD10) U10.4(I/O3) ; port MED10
MED11: U9.164(MD11) U10.37(I/O14) ; port MED11
MED12: U9.163(MD12) U10.3(I/O2) ; port MED12
MED13: U9.162(MD13) U10.38(I/O15) ; port MED13
MED14: U9.161(MD14) U10.2(I/O1) ; port MED14
MED15: U9.160(MD15) U10.39(I/O16) ; port MED15
MEOE: U9.181(XOE) U10.27(OE) ; port MEOE
MERAS: U9.182(XRAS) U10.14(RAS) ; port MERAS
MEWE: U9.179(XWE) U10.13(WE) ; port MEWE
MINT: U9.79(XINT) U11.30(XINT) ; port MINT
MRD: U9.96(XRD) U11.48(DECRD) ; port MRD
MWR: U9.95(XWR) U11.47(DECWR) ; port MWR
NTPL: U6.157(NTPL) U8.13(NT/PAL) ; port NTPL
PCK: R17.1 U1.160(TCLK0) U8.41(VCLK) ; port PCK
RAB0: U1.68(DA0) U2.28(A0) ; port RAB0
RAB1: U1.67(DA1) U2.29(A1) ; port RAB1
RAB2: U1.64(DA2) U2.30(A2) ; port RAB2
RAB3: U1.63(DA3) U2.31(A3) ; port RAB3
RAB4: U1.62(DA4) U2.32(A4) ; port RAB4
RAB5: U1.61(DA5) U2.33(A5) ; port RAB5
RAB6: U1.60(DA6) U2.34(A6) ; port RAB6
RAB7: U1.59(DA7) U2.37(A7) ; port RAB7
RAB8: U1.58(DA8) ; port RAB8
RAB9: U1.57(DA9) U2.39(A9) ; port RAB9
RAB10: U1.56(DA10) ; port RAB10
RAB11: U1.55(DA11) U2.38(A8) ; port RAB11
RDB0: U1.42(DD0) U2.2(I/O1) ; port RDB0
RDB1: U1.41(DD1) U2.3(I/O2) ; port RDB1
RDB2: U1.40(DD2) U2.4(I/O3) ; port RDB2
RDB3: U1.37(DD3) U2.5(I/O4) ; port RDB3
RDB4: U1.36(DD4) U2.7(I/O5) ; port RDB4
RDB5: U1.35(DD5) U2.8(I/O6) ; port RDB5
RDB6: U1.34(DD6) U2.9(I/O7) ; port RDB6
RDB7: U1.33(DD7) U2.10(I/O8) ; port RDB7
RDB8: U1.32(DD8) U2.13(I/O9) ; port RDB8
RDB9: U1.31(DD9) U2.14(I/O10) ; port RDB9
RDB10: U1.30(DD10) U2.15(I/O11) ; port RDB10
RDB11: U1.29(DD11) U2.16(I/O12) ; port RDB11
RDB12: U1.28(DD12) U2.18(I/O13) ; port RDB12
RDB13: U1.25(DD13) U2.19(I/O14) ; port RDB13
RDB14: U1.24(DD14) U2.20(I/O15) ; port RDB14
RDB15: U1.23(DD15) U2.21(I/O16) ; port RDB15
RDB16: U1.22(DD16) U2.50(I/O17) ; port RDB16
RDB17: U1.21(DD17) U2.51(I/O18) ; port RDB17
RDB18: U1.20(DD18) U2.52(I/O19) ; port RDB18
RDB19: U1.19(DD19) U2.53(I/O20) ; port RDB19
RDB20: U1.18(DD20) U2.55(I/O21) ; port RDB20
RDB21: U1.17(DD21) U2.56(I/O22) ; port RDB21
RDB22: U1.16(DD22) U2.57(I/O23) ; port RDB22
RDB23: U1.13(DD23) U2.58(I/O24) ; port RDB23
RDB24: U1.12(DD24) U2.61(I/O25) ; port RDB24
RDB25: U1.11(DD25) U2.62(I/O26) ; port RDB25
RDB26: U1.10(DD26) U2.63(I/O27) ; port RDB26
RDB27: U1.9(DD27) U2.64(I/O28) ; port RDB27
RDB28: U1.8(DD28) U2.66(I/O29) ; port RDB28
RDB29: U1.7(DD29) U2.67(I/O30) ; port RDB29
RDB30: U1.6(DD30) U2.68(I/O31) ; port RDB30
RDB31: U1.5(DD31) U2.69(I/O32) ; port RDB31
RED0: U6.180(SR0) U8.24(RDATA0) ; port RED0
RED1: U6.181(SR1) U8.23(RDATA1) ; port RED1
RED2: U6.182(SR2) U8.22(RDATA2) ; port RED2
RED3: U6.183(SR3) U8.21(RDATA3) ; port RED3
RED4: U6.186(SR4) U8.19(RDATA4) ; port RED4
RED5: U6.187(SR5) U8.18(RDATA5) ; port RED5
RED6: U6.188(SR6) U8.17(RDATA6) ; port RED6
RED7: U6.189(SR7) U8.16(RDATA7) ; port RED7
RES3.3: C23.2 R4.2 U1.76(#EXT_RESET) U6.6(#RST) ; port RES3.3
SA0: R9.2 U5.12(A0) U9.105(HA0) ; port SA0
SA1: U1.126(SA1) U5.11(A1) U9.107(HA1) ; port SA1
SA2: U1.127(SA2) U5.10(A2) U9.108(HA2) ; port SA2
SA3: U1.128(SA3) U5.9(A3) U9.109(HA3) ; port SA3
SA4: U1.129(SA4) U5.8(A4) U9.110(HA4) ; port SA4
SA5: U1.132(SA5) U5.7(A5) U9.111(HA5) ; port SA5
SA6: U1.133(SA6) U5.6(A6) U9.113(HA6) ; port SA6
SA7: U1.134(SA7) U5.5(A7) U9.114(HA7) ; port SA7
SA8: U1.135(SA8) U5.27(A8) U9.115(HA8) ; port SA8
SA9: U1.136(SA9) U5.26(A9) U9.116(HA9) ; port SA9
SA10: U1.137(SA10) U5.23(A10) ; port SA10
SA11: U1.138(SA11) U5.25(A11) ; port SA11
SA12: U1.139(SA12) U5.4(A12) ; port SA12
SA13: U1.140(SA13) U5.28(A13) ; port SA13
SA14: U1.141(SA14) U5.29(A14) ; port SA14
SA15: U1.142(SA15) U5.3(A15) ; port SA15
SA16: U1.145(SA16) U5.2(A16) ; port SA16
SA17: U1.146(SA17) U5.30(A17) ; port SA17
SA18: U1.147(SA18) U5.31(A18) ; port SA18
SA19: U1.148(SA19) U5.1(A19) ; port SA19
SA20: U1.149(SA20) ; port SA20
SA21: U1.150(SA21) ; port SA21
SA22: U1.151(SA22) ; port SA22
SA23: U1.152(SA23) ; port SA23
SCLK: U9.1(SCLK) U11.29(ROMSEL) ; port SCLK
SCOR: U9.77(SCOR) U11.31(SCOR) ; port SCOR
SD0: U1.107(SD0) U5.13(D0) U9.142(HD0) ; port SD0
SD1: U1.108(SD1) U5.14(D1) U9.141(HD1) ; port SD1
SD2: U1.109(SD2) U5.15(D2) U9.140(HD2) ; port SD2
SD3: U1.110(SD3) U5.17(D3) U9.139(HD3) ; port SD3
SD4: U1.111(SD4) U5.18(D4) U9.138(HD4) ; port SD4
SD5: U1.112(SD5) U5.19(D5) U9.136(HD5) ; port SD5
SD6: U1.113(SD6) U5.20(D6) U9.135(HD6) ; port SD6
SD7: U1.114(SD7) U5.21(D7) U9.134(HD7) ; port SD7
SD8: U1.115(SD8) U9.133(HD8) ; port SD8
SD9: U1.116(SD9) U9.132(HD9) ; port SD9
SD10: U1.119(SD10) U9.130(HD10) ; port SD10
SD11: U1.120(SD11) U9.129(HD11) ; port SD11
SD12: U1.121(SD12) U9.128(HD12) ; port SD12
SD13: U1.122(SD13) U9.127(HD13) ; port SD13
SD14: U1.123(SD14) U9.126(HD14) ; port SD14
SD15: U1.124(SD15) U9.125(HD15) ; port SD15
SENS: U9.82(SENS) U11.23(SENSE) ; port SENS
SPMUTE: U9.154(MUT0) ; port SPMUTE
SPUCS: RN7.2 U9.104(XSCX) ; port SPUCS
SPUDACK: U1.87(DACK4) U9.121(DACK) ; port SPUDACK
SPUDREQ: U1.88(DREQ4) U9.124(DREQ) ; port SPUDREQ
SPUINT: U1.90(#INTIN9) U9.118(XIRQ) ; port SPUINT
SQCK: U9.80(SQCK) U11.26(SQCK) ; port SQCK
SRD: RN6.3 U5.24(#OE) U9.119(XHRD) ; port SRD
SUBQ: U9.81(SQSO) U11.24(SUBQ) ; port SUBQ
SWR0: RN6.4 U9.120(XHWR) ; port SWR0
SYSCLK0: R11.2 U6.9(#SYSCLK) ; port SYSCLK0
SYSCLK1: R16.2 U9.144(SYSCK) ; port SYSCLK1
VBLANK: U1.199(#INTIN0) U6.17(VBLNK) ; port VBLANK
VCKN-A: R8.2 U6.192(VCKN-A) U6.196(VCKP-A) ; port VCKN-A
VIDEO_OUT_B: RN9.6 ; port VIDEO_OUT_B
VIDEO_OUT_C: C20.2 ; port VIDEO_OUT_C
VIDEO_OUT_G: RN9.7 ; port VIDEO_OUT_G
VIDEO_OUT_R: RN9.8 ; port VIDEO_OUT_R
VIDEO_OUT_V: C19.2 ; port VIDEO_OUT_V
VIDEO_OUT_Y: C18.2 ; port VIDEO_OUT_Y
XLT0: RN8.2 U9.75(XLAT) ; port XLT0
XRST: C24.2 R4.1 U9.152(XRST) U11.13(RESET) ; port XRST
NetC8_1: C8.1 C9.1 U3.7(VDD) U3.8(OE)
NetC17_1: C17.1 R1.1 U8.15(SCIN)
NetC18_1: C18.1 RN9.5
NetC19_1: C19.1 RN10.7
NetC20_1: C20.1 RN10.8
NetC21_2: C21.2 U8.44(VREFOUT)
NetC22_2: C22.2 L1.2 U11.2(VDD) U11.32(VDD)
NetR2_2: R2.2 U1.98(#CS0)
NetR3_1: R3.1 U8.10(YTRAP)
NetR5_5: R5.5 U7.9(DQ16)
NetR5_6: R5.6 U7.10(DQ17)
NetR5_7: R5.7 U7.12(DQ18)
NetR5_8: R5.8 U7.13(DQ19)
NetR6_5: R6.5 U7.17(DQ20)
NetR6_6: R6.6 U7.18(DQ21)
NetR6_7: R6.7 U7.20(DQ22)
NetR6_8: R6.8 U7.21(DQ23)
NetR7_2: R7.2 U3.5(CLKB)
NetR8_1: R8.1 U3.1(CLKA)
NetR9_1: R9.1 U1.125(SA0)
NetR10_1: R10.1 U7.74(DQ24)
NetR10_2: R10.2 U7.75(DQ25)
NetR10_3: R10.3 U7.77(DQ26)
NetR10_4: R10.4 U7.78(DQ27)
NetR11_1: R11.1 U1.201(SYSCLK0)
NetR12_1: R12.1 U7.68(DQ12)
NetR12_2: R12.2 U7.69(DQ13)
NetR12_3: R12.3 U7.71(DQ14)
NetR12_4: R12.4 U7.72(DQ15)
NetR13_1: R13.1 U7.60(DQ8)
NetR13_2: R13.2 U7.61(DQ9)
NetR13_3: R13.3 U7.63(DQ10)
NetR13_4: R13.4 U7.64(DQ11)
NetR14_1: R14.1 U7.80(DQ28)
NetR14_2: R14.2 U7.81(DQ29)
NetR14_3: R14.3 U7.83(DQ30)
NetR14_4: R14.4 U7.84(DQ31)
NetR15_1: R15.1 U7.97(DQ0)
NetR15_2: R15.2 U7.98(DQ1)
NetR15_3: R15.3 U7.100(DQ2)
NetR15_4: R15.4 U7.1(DQ3)
NetR16_1: R16.1 U1.154(SYSCLK1)
NetR17_2: R17.2 U6.199(PCK)
NetR18_1: R18.1 U6.18(HVHLD)
NetR20_5: R20.5 U7.3(DQ4)
NetR20_6: R20.6 U7.4(DQ5)
NetR20_7: R20.7 U7.6(DQ6)
NetR20_8: R20.8 U7.7(DQ7)
NetR58_1: R58.1 U7.54(CKE)
NetRN1_1: RN1.1 U1.203(#VWR)
NetRN1_2: RN1.2 U1.204(#VRD)
NetRN1_3: RN1.3 U1.205(#CS7)
NetRN1_4: RN1.4 U1.206(DSYSCLK)
NetRN2_1: RN2.1 U1.46(#DCAS3)
NetRN2_2: RN2.2 U1.47(#DCAS2)
NetRN2_3: RN2.3 U1.48(#DCAS1)
NetRN2_4: RN2.4 U1.49(#DCAS0)
NetRN3_2: RN3.2 U1.43(#DWE)
NetRN3_4: RN3.4 U1.45(#DRAS0)
NetRN4_1: RN4.1 U6.125(#CAS)
NetRN4_2: RN4.2 U6.126(#WE)
NetRN4_3: RN4.3 U6.127(DQMH)
NetRN4_4: RN4.4 U6.128(DQML)
NetRN5_1: RN5.1 U6.122(#MCS0)
NetRN5_2: RN5.2 U6.123(DSF)
NetRN5_3: RN5.3 U6.124(#RAS)
NetRN6_5: RN6.5 U1.100(#SWR0)
NetRN6_6: RN6.6 U1.101(#SRD)
NetRN7_6: RN7.6 U1.95(#CS5)
NetRN7_7: RN7.7 U1.96(#CS4)
NetRN7_8: RN7.8 U1.97(#CS2)
NetRN8_6: RN8.6 U11.43(DATA)
NetRN8_7: RN8.7 U11.44(XLT)
NetRN8_8: RN8.8 U11.45(CLK)
NetRN9_1: RN9.1 U8.3(ROUT)
NetRN9_2: RN9.2 U8.4(GOUT)
NetRN9_3: RN9.3 U8.5(BOUT)
NetRN9_4: RN9.4 U8.6(YOUT)
NetRN10_1: RN10.1 U8.7(COUT)
NetRN10_2: RN10.2 U8.8(VOUT)
NetU3_3: U3.3(XTALIN) U4.1
NetU3_4: U3.4(XTALOUT) U4.2

Not connected (* = marked no-connect by the designer): RN3 1 3 6 8; RN5 4 5; RN6 1 2 7 8; RN7 4 5; RN8 4 5; RN10 3 4 5 6; U1 3(CRYSTALN) 44(#DRAS1) 70(#RTS1) 71(#CTS1) 72(#DTR1) 73(#DSR1) 74(TXD1) 75(RXD1) 77(#DTROB) 80(#DTROA) 81(#SCK0) 82(#DSR0) 83(TXD.0) 84(RXD.0) 85(DACK5) 86(DREQ5) 89(#INTIN10) 99(#SWR1); U2 22(N.C) 23(N.C) 24(N.C) 25(N.C) 26(N.C) 40(N.C) 41(N.C) 42(N.C); U6 21(N.C) 68(PCKSL2) 69(PCKSL1) 70(PCKSL0) 121(#MCS1) 153(FSC) 158(#VSYNC) 159(#HSYNC) 202(DMASK) 203(ODE2); U7 36(N.C) 37(N.C) 38(N.C) 39(N.C) 40(N.C) 41(N.C) 42(N.C) 43(N.C) 44(N.C) 45(N.C) 86(N.C) 87(N.C) 88(N.C) 89(N.C) 90(N.C) 91(N.C) 92(N.C) 93(N.C) 94(N.C) 95(N.C); U8 1(BCLAMP) 11(N.C) 12(POWER_SAVE) 43(VREFIN) 46(RCRAMP) 48(GCLAMP); U9 4(SBSO) 5(WFCK) 7(C16M) 9(C4M) 12(FSTO) 13(V16M) 14(DOUT) 15(LRCK) 16(WDCK) 18(LOCK) 20(MDS) 21(MDP) 23(AVDO) 24(ASYO) 25(ASYI) 26(BIAS) 27(RFAC) 29(CLTV) 30(PCO) 31(FILI) 32(FILO) 33(VCTL) 34(VPCO2) 35(VPCO1) 36(VC) 37(FE) 38(SE) 39(TE) 40(CE) 41(CEO) 42(CEI) 43(RFDC) 44(ADIO) 46(IGEN) 47(AVD1) 48(MTS3) 53(FADA) 54(FFDA) 55(TADA) 57(TFDR) 58(SRDR) 59(SFDR) 60(MON) 62(FSW) 64(FOK) 65(DFCT) 66(MIRA) 67(COUT) 68(DA08) 70(DA04) 71(DA03) 72(DA02) 73(DA01) 145(XCK) 146(AVDD) 147(AOUTL) 150(AOUTR) 151(AVDD) 155(DAT0) 156(LRC0) 157(BCK0) 158(DTIB) 194(DA05) 195(DA06) 197(DA07) 198(DA09) 199(DA10) 200(DA11) 202(DA12) 203(DA13) 204(DA14) 206(DA15) 207(DA16); U10 11(N.C) 12(N.C) 15(N.C) 30(N.C); U11 1(N.C) 3(N.C) 4(N.C) 5(N.C) 15(OSC2) 16(F-BIAS) 17(CG) 20(TEST2) 21(TEST1) 22(COUT) 25(N.C) 27(SPEED) 28(AL/TE) 42(N.C) 49(LDON) 50(N.C) 51(N.C) 52(N.C)

## Notes on the sheet
- RGB ENCODER
- VIDEO RAM
- MECH CON

## Library data of the parts
C1 C8 C15 C20-C22 = 0.1u: nameAlias: Value(F); Contributor: LCEDA_Lib; spicePre: C; spiceSymbolName: C_0603_EU
C2 C6 = 100p: nameAlias: Value(F); Contributor: LCEDA_Lib; spicePre: C; spiceSymbolName: C_0603_EU
C3 C10 C12 C13 = 0.01u: nameAlias: Value(F); Contributor: LCEDA_Lib; spicePre: C; spiceSymbolName: C_0603_EU
C4 C5 C7 C9 C11 C14 C16 = 0.001u: nameAlias: Value(F); Contributor: LCEDA_Lib; spicePre: C; spiceSymbolName: C_0603_EU
C17 = 5p: nameAlias: Value(F); Contributor: LCEDA_Lib; spicePre: C; spiceSymbolName: C_0603_EU
C18 C19 = 220u 4V: nameAlias: Value(F); Contributor: LCEDA_Lib; spicePre: C; spiceSymbolName: C_Tan_SMD_A_US
C23 C24 = 1u: nameAlias: Value(F); Contributor: LCEDA_Lib; spicePre: C; spiceSymbolName: C_0603_EU
L1 = 10u: nameAlias: Value(H); Contributor: LCEDA_Lib; spicePre: L; spiceSymbolName: L0603_US
R1 = 2.2k: nameAlias: Value(Ω); Contributor: LCEDA_Lib; spicePre: R; spiceSymbolName: R_0603_EU
R2 = 10k: nameAlias: Value(Ω); Contributor: LCEDA_Lib; spicePre: R; spiceSymbolName: R_0603_EU
R3 = 3.3k: nameAlias: Value(Ω); Contributor: LCEDA_Lib; spicePre: R; spiceSymbolName: R_0603_EU
R4 = 5.6k: nameAlias: Value(Ω); Contributor: LCEDA_Lib; spicePre: R; spiceSymbolName: R_0603_EU
R5 R6 R10 R12-R15 R20 = 82Ω: Manufacturer: YAGEO(国巨); Manufacturer Part: YC124-FR-0782RL; Contributor: LCSC; nameAlias: Value; Supplier: LCSC; Supplier Part: C728756; JLCPCB Part Class: Extended Part; spicePre: R; spiceSymbolName: YC124-FR-0782RL
R7 R9 R11 R16 R17 = 22: nameAlias: Value(Ω); Contributor: LCEDA_Lib; spicePre: R; spiceSymbolName: R_0603_EU
R8 = 220: nameAlias: Value(Ω); Contributor: LCEDA_Lib; spicePre: R; spiceSymbolName: R_0603_EU
R18 R58 = 4.7K: nameAlias: Value(Ω); Contributor: LCEDA_Lib; spicePre: R; spiceSymbolName: R_0603_EU
RN1-RN6 RN8 = 22Ω: Manufacturer: UNI-ROYAL(厚声); Manufacturer Part: 4D02WGJ0220TCE; nameAlias: Value; Supplier: LCSC; Supplier Part: C25499; JLCPCB Part Class: Extended Part; spicePre: R; spiceSymbolName: 4D02WGJ0220TCE
RN7 = 100Ω: Manufacturer: UNI-ROYAL(厚声); Manufacturer Part: 4D02WGJ0220TCE; nameAlias: Value; Supplier: LCSC; Supplier Part: C25499; JLCPCB Part Class: Extended Part; spicePre: R; spiceSymbolName: 4D02WGJ0220TCE
RN9 RN10 = 75Ω: Manufacturer: UNI-ROYAL(厚声); Manufacturer Part: 4D02WGF750JTCE; nameAlias: Value; Contributor: LCSC; Supplier: LCSC; Supplier Part: C425284; JLCPCB Part Class: Extended Part; spicePre: R; spiceSymbolName: 4D02WGF750JTCE
U1 = IC103: Manufacturer: SONY; Contributor: lorentiobrodesco1; spicePre: U; spiceSymbolName: IC103
U2 = IC106: Contributor: lorentiobrodesco1; spicePre: U; spiceSymbolName: IC106
U3 = IC204: Contributor: lorentiobrodesco1; spicePre: U; spiceSymbolName: IC204
U4 = 17MHz: Manufacturer: Huiyuan crystal(惠源晶工); Manufacturer Part: HY4M49SSMDOB1R20; nameAlias: Value; Contributor: lcsc; Supplier: LCSC; Supplier Part: C5265769; JLCPCB Part Class: Extended Part; spicePre: U; spiceSymbolName: HY4M49SSMDOB1R20
U5 = IC102: Contributor: lorentiobrodesco1; spicePre: U; spiceSymbolName: IC102
U6 = IC203: Manufacturer: SONY; Contributor: lorentiobrodesco1; spicePre: U; spiceSymbolName: IC203
U7 = IC201: Contributor: lorentiobrodesco1; spicePre: U; spiceSymbolName: IC201
U8 = IC502: Contributor: lorentiobrodesco1; spicePre: U; spiceSymbolName: IC502
U9 = IC723: Manufacturer: SONY; Contributor: lorentiobrodesco1; spicePre: U; spiceSymbolName: IC723
U10 = IC310: Contributor: lorentiobrodesco1; spicePre: U; spiceSymbolName: IC310
U11 = IC304: Contributor: lorentiobrodesco1; spicePre: U; spiceSymbolName: IC304